# Altium schematic sheet Sheet1.SchDoc
size A; SheetNumber: 1; SheetTotal: 1
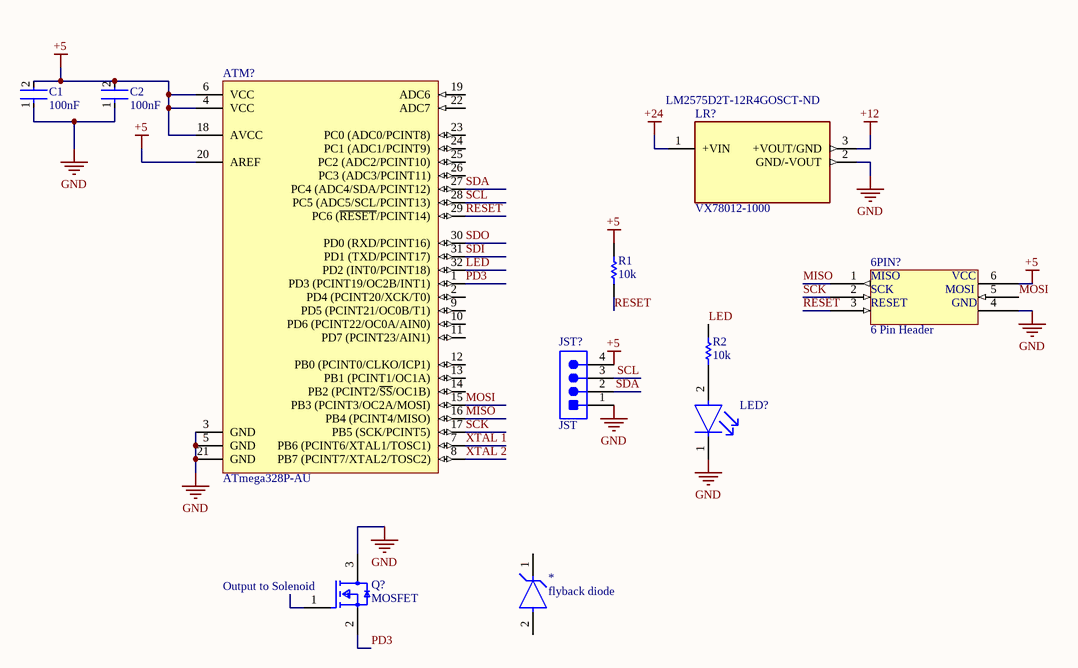
[diagram p0: Sheet1.SchDoc]

## Parts
6PIN?  6 Pin Header  [6 PIN HEADER]
*  flyback diode  [flyback diode - duplicate]
ATM?  ATmega328P-AU  [32A_M]
C1  100nF  [FP-CL779-IPC_C]
C2  100nF  [FP-CL779-IPC_C]
JST?  JST  [JST]
LED?  LED  [LED]  (value not drawn)
LR?  VX78012-1000  Supplier Part Number 1: LM2575D2T-12R4GOSCT-ND  [VX78012-1000]
Q?  MOSFET  [FP-SOT23-MFG]
R1  10k  [RESC1608X06N]
R2  10k  [RESC1608X06N]

## Nets
+5: 6PIN?.6 ATM?.4(VCC) ATM?.6(VCC) ATM?.18(AVCC) ATM?.20(AREF) C1.2 C2.2 JST?.4 R1.2
+12: LR?.3(+VOUT/GND)
+24: LR?.1(+VIN)
GND: 6PIN?.4 ATM?.3(GND) ATM?.5(GND) ATM?.21(GND) C1.1 C2.1 JST?.1 LED?.1(C) LR?.2(GND/-VOUT) Q?.3(D)
LED: ATM?.32(PD2_(INT0/PCINT18)) R2.2
MISO: 6PIN?.1 ATM?.16(PB4_(PCINT4/MISO))
MOSI: 6PIN?.5 ATM?.15(PB3_(PCINT3/OC2A/MOSI))
PD3: ATM?.1(PD3_(PCINT19/OC2B/INT1)) Q?.2(S)
RESET: 6PIN?.3 ATM?.29(PC6_(~{RESET}/PCINT14)) R1.1
SCK: 6PIN?.2 ATM?.17(PB5_(SCK/PCINT5))
SCL: ATM?.28(PC5_(ADC5/SCL/PCINT13)) JST?.3
SDA: ATM?.27(PC4_(ADC4/SDA/PCINT12)) JST?.2
SDI: ATM?.31(PD1_(TXD/PCINT17))
SDO: ATM?.30(PD0_(RXD/PCINT16))
XTAL 1: ATM?.7(PB6_(PCINT6/XTAL1/TOSC1))
XTAL 2: ATM?.8(PB7_(PCINT7/XTAL2/TOSC2))
NetLED?_2: LED?.2(A) R2.1

Not connected (* = marked no-connect by the designer): * 1(C) 2(A); ATM? 2(PD4_(PCINT20/XCK/T0)) 9(PD5_(PCINT21/OC0B/T1)) 10(PD6_(PCINT22/OC0A/AIN0)) 11(PD7_(PCINT23/AIN1)) 12(PB0_(PCINT0/CLKO/ICP1)) 13(PB1_(PCINT1/OC1A)) 14(PB2_(PCINT2/~{SS}/OC1B)) 19(ADC6) 22(ADC7) 23(PC0_(ADC0/PCINT8)) 24(PC1_(ADC1/PCINT9)) 25(PC2_(ADC2/PCINT10)) 26(PC3_(ADC3/PCINT11)); Q? 1(G)

## Notes on the sheet
- (near Q?) Output to Solenoid
- (in symbol 6 Pin Header) MISO; VCC; SCK; MOSI; RESET; GND

## Library data of the parts
ATM? = CMP-0095-00269-2: 8-bit AVR Microcontroller, 32KB Flash, 1KB EEPROM, 2KB SRAM, 32-pin TQFP, Industrial Grade (-40°C to 85°C); PackageDescription: 32-Lead, 7x7x1.0 mm Body, 0.8mm Lead Pitch, Thin Profile Plastic Quad Flat Package (TQFP); DatasheetVersion: revD, May-2011; RevisionNote: DatasheetVersion & PackageVersion updated. URLs added.; ComponentLink1URL: http://www.atmel.com/; ComponentLink2Description: ATmega48A/48PA/88A/88PA/168A/168PA/328/328P Datasheet; Code_JEDEC: MS-026-ABA; ComponentLink1Description: Manufacturer URL; PackageReference: 32A; ComponentLink3Description: ATmega48A/48PA/88A/88PA/168A/168PA/328/328P Summary; ComponentLink2URL: http://www.atmel.com/dyn/resources/prod_documents/doc8271.pdf; PackageVersion: revC, Oct-2010; ComponentLink3URL: http://www.atmel.com/dyn/resources/prod_documents/8271S.pdf
C1 C2 = CMP-13271-002336-1: Cap Ceramic 100nF 50V X7R ±10% SMD 0402 +125°C Paper T/R
LR? = VX78012-1000: MF: {'manufacturer': u'CUI'}; Availability: Unavailable; MP: VX78012-1000; Value: *; Package: None; Price: None; Supplier 1: Digi-Key
Q? = CMP-83955-000006-1: MOSFET N-CH 30V 5.7A SOT23, part number: AO3400A; Input Capacitance: 630pF; Number of Elements: 1; Rds On Max: 26.5mR; Max Power Dissipation: 1.4W; Gate to Source Voltage (Vgs): 12V; Min Operating Temperature: -55°C; Lead Free: Lead Free; Number of Pins: 3; Drain to Source Voltage (Vdss): 30V; Case/Package: SOT-23; Mount: Surface Mount; Continuous Drain Current (ID): 5.7A; Radiation Hardening: No; Packaging: Tape and Reel; Max Operating Temperature: 150°C; Power Dissipation: 1.4W
R1 R2 = 10k resistor: Supplier 1: Digi-Key; Supplier Part Number 1: 311-10KLECT-ND
* = flyback diode: Supplier 1: Digi-Key; Supplier Part Number 1: SS14-E3/61TGICT-ND
JST? = JST: Supplier 1: RSComponents; Supplier Part Number 1: 8201434
LED? = LED: Supplier 1: Digi-Key; Supplier Part Number 1: BL-HKC37A-AV-TRBCT-ND